# EAGLE design save (EAGLE 7.6.0)
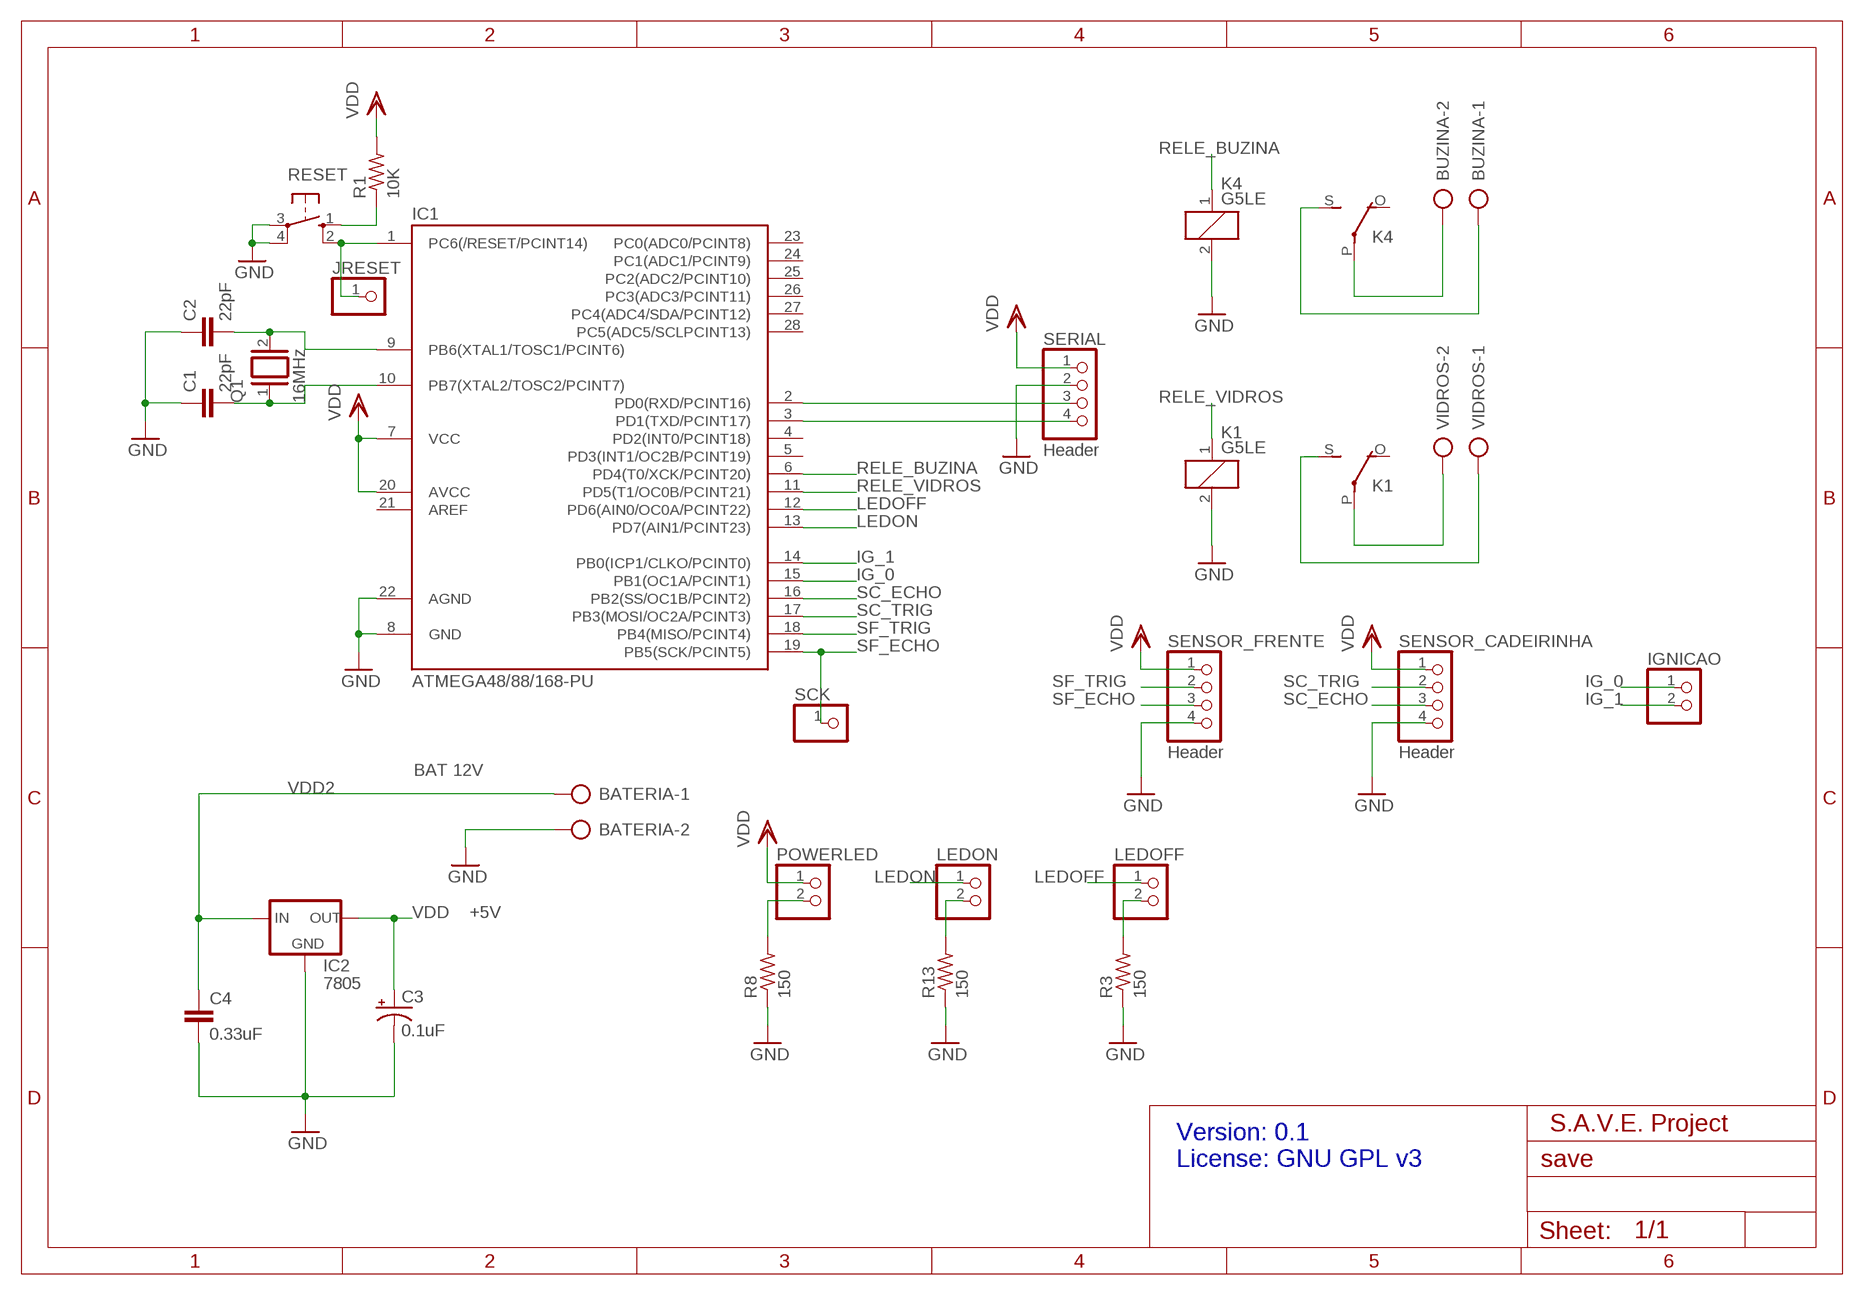
[diagram p0: schematic, sheet 1]

## Parts
BATERIA  AK300/2  [AK300/2]
BUZINA  AK300/2  [AK300/2]
C1  22pF  C-EU050-024X044  [C050-024X044]
C2  22pF  C-EU050-024X044  [C050-024X044]
C3  0.1uF  CPOL-USE2-4  [E2-4]
C4  0.33uF  C-EU025-030X050  [C025-030X050]
IC1  ATMEGA48/88/168-PU  [DIL28-3]
IC2  7805  78XXL  [78XXL]
IGNICAO  PINHD-1X2/90  [1X02/90]
JRESET  PINHD-1X1  [1X01]
K1  G5LE  [G5LE]
K4  G5LE  [G5LE]
LEDOFF  PINHD-1X2/90  [1X02/90]
LEDON  PINHD-1X2/90  [1X02/90]
POWERLED  PINHD-1X2/90  [1X02/90]
Q1  16MHz  XTAL/S  [QS]
R1  10K  R-US_0207/10  [0207/10]
R3  150  R-US_0207/10  [0207/10]
R8  150  R-US_0207/10  [0207/10]
R13  150  R-US_0207/10  [0207/10]
RESET  10-XX  [B3F-10XX]
SCK  PINHD-1X1  [1X01]
SENSOR_CADEIRINHA  Header  PINHD-1X4  [1X04]
SENSOR_FRENTE  Header  PINHD-1X4  [1X04]
SERIAL  Header  PINHD-1X4  [1X04]
VIDROS  AK300/2  [AK300/2]

## Nets
BUZINA-2: BUZINA.2 K4.P(2:P)
GND: BATERIA.2 C1.1 C2.1 C3.- C4.2 IC1.8(GND) IC1.22(AGND) IC2.GND K1.2 K4.2 R3.1 R8.1 R13.1 RESET.3(P) RESET.4(P1) SENSOR_CADEIRINHA.4 SENSOR_FRENTE.4 SERIAL.2
IG_0: IC1.15(PB1(OC1A/PCINT1)) IGNICAO.1
IG_1: IC1.14(PB0(ICP1/CLKO/PCINT0)) IGNICAO.2
LEDOFF: IC1.12(PD6(AIN0/OC0A/PCINT22)) LEDOFF.1
LEDON: IC1.13(PD7(AIN1/PCINT23)) LEDON.1
N$2: BUZINA.1 K4.S(2:S)
N$3: R1.1 RESET.1(S)
N$4: IC1.1(PC6(/RESET/PCINT14)) JRESET.1 RESET.2(S1)
N$6: C1.2 IC1.10(PB7(XTAL2/TOSC2/PCINT7)) Q1.1
N$7: C2.2 IC1.9(PB6(XTAL1/TOSC1/PCINT6)) Q1.2
N$8: K1.S(2:S) VIDROS.1
N$10: LEDOFF.2 R3.2
N$11: K1.P(2:P) VIDROS.2
N$21: POWERLED.2 R8.2
N$23: LEDON.2 R13.2
RELE_BUZINA: IC1.6(PD4(T0/XCK/PCINT20)) K4.1
RELE_VIDROS: IC1.11(PD5(T1/OC0B/PCINT21)) K1.1
RX: IC1.2(PD0(RXD/PCINT16)) SERIAL.3
SC_ECHO: IC1.16(PB2(SS/OC1B/PCINT2)) SENSOR_CADEIRINHA.3
SC_TRIG: IC1.17(PB3(MOSI/OC2A/PCINT3)) SENSOR_CADEIRINHA.2
SF_ECHO: IC1.19(PB5(SCK/PCINT5)) SCK.1 SENSOR_FRENTE.3
SF_TRIG: IC1.18(PB4(MISO/PCINT4)) SENSOR_FRENTE.2
TX: IC1.3(PD1(TXD/PCINT17)) SERIAL.4
VDD: C3.+ IC1.7(VCC) IC1.20(AVCC) IC2.OUT POWERLED.1 R1.2 SENSOR_CADEIRINHA.1 SENSOR_FRENTE.1 SERIAL.1
VDD2: BATERIA.1 C4.1 IC2.IN
Unconnected: IC1.4(PD2(INT0/PCINT18)) IC1.5(PD3(INT1/OC2B/PCINT19)) IC1.21(AREF) IC1.23(PC0(ADC0/PCINT8)) IC1.24(PC1(ADC1/PCINT9)) IC1.25(PC2(ADC2/PCINT10)) IC1.26(PC3(ADC3/PCINT11)) IC1.27(PC4(ADC4/SDA/PCINT12)) IC1.28(PC5(ADC5/SCLPCINT13)) K1.O(2:O) K4.O(2:O)

## Notes on the sheet
- BAT 12V
- +5V
- S.A.V.E. Project
- Version: 0.1
  License: GNU GPL v3

## Library data of the parts
BATERIA BUZINA VIDROS = con-ptr500:AK300/2: CONNECTOR; OC_FARNELL: unknown; OC_NEWARK: unknown
C1 C2 = rcl:C-EU: CAPACITOR, European symbol
C3 = resistor:CPOL-US: POLARIZED CAPACITOR, American symbol
C4 = resistor:C-EU: CAPACITOR, European symbol
IC1 = atmega8:ATMEGA48/88/168-PU
IC2 = v-reg:78XXL: VOLTAGE REGULATOR
IGNICAO LEDOFF LEDON POWERLED = pinhead:PINHD-1X2: PIN HEADER
JRESET SCK = pinhead:PINHD-1X1: PIN HEADER
K1 K4 = relay:G5LE: RELAY 1 x switch, 10 A/120 V AC, 8 A/30 V DC, Omron; OC_FARNELL: unknown; OC_NEWARK: unknown
Q1 = special:XTAL/S: CRYSTAL
R1 R3 R8 R13 = rcl:R-US_: RESISTOR, American symbol
RESET = switch-omron:10-XX: OMRON SWITCH; MPN: B3F-1000; OC_FARNELL: 176432; OC_NEWARK: 36M3542
SENSOR_CADEIRINHA SENSOR_FRENTE SERIAL = pinhead:PINHD-1X4: PIN HEADER

## Board
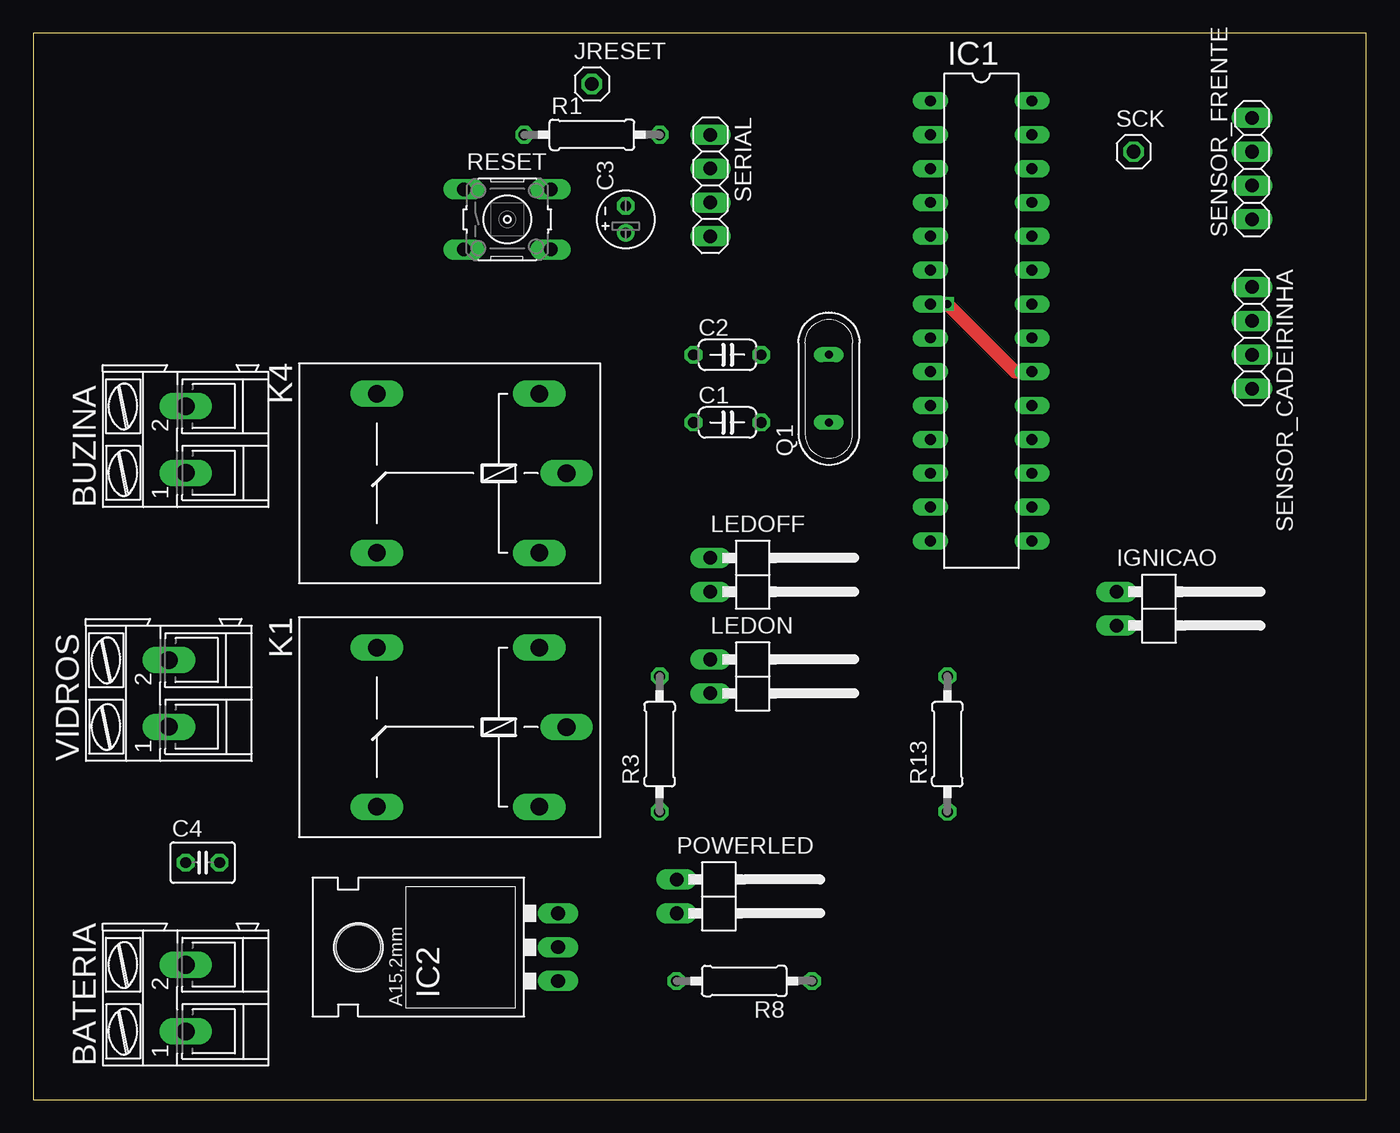
[diagram p1: board, top side]
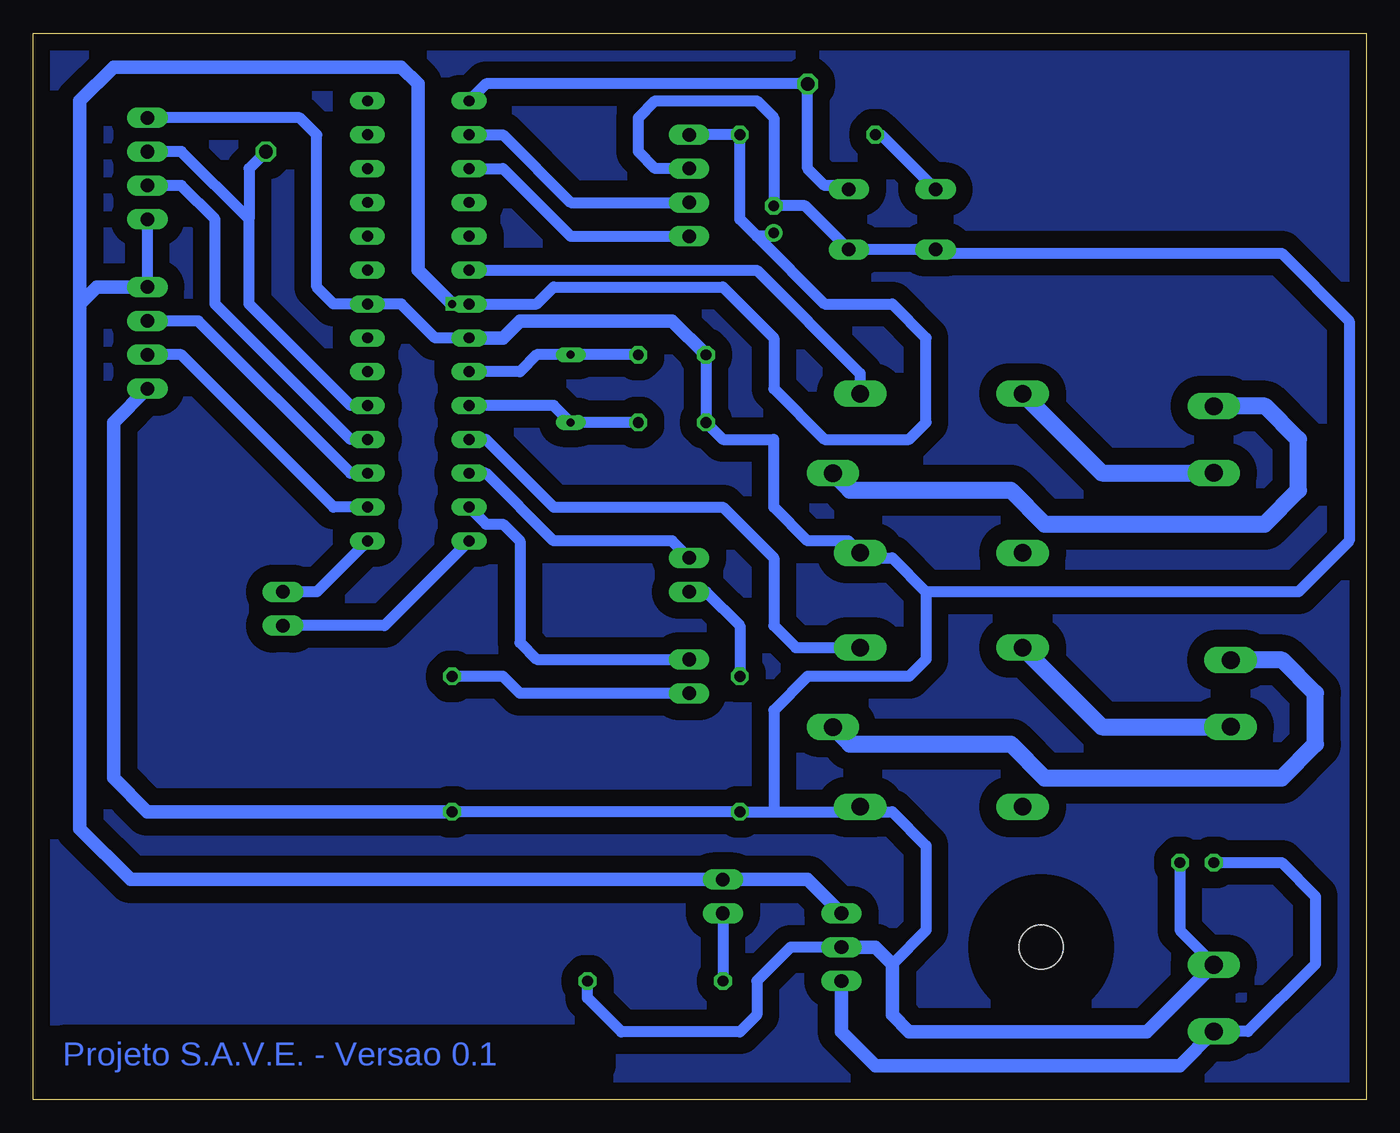
[diagram p2: board, bottom side, seen from below]

Size 100 x 80 mm. Coordinates in mm from the lower left corner, seen from the top.
Outline: 0,0 100,0 100,80 0,80 0,0
Copper layers (1*16): Top 0.035mm / dielectric 1.5mm / Bottom 0.035mm
Design rules "default": minimum track width 10mil, minimum drill 24mil, track to track 8mil, track to pad 8mil, pad to pad 8mil, via to via 8mil, smd to smd 8mil, copper to edge 40mil, drill to drill 8mil, minimum pad ring 10mil, minimum via ring 8mil, stop-mask expansion 4mil, vias tented up to drill 0mil, thermal gap 10mil

### Footprints (pad centres in the part's own frame; a part is rotated, then mirrored left to right if it is on the bottom)
AK300/2 = drill 1.321 long: 1 -2.515,0; 2 2.489,0
C050-024X044 = drill 0.813 octagon: 1 -2.54,0; 2 2.54,0
E2-4 = drill 0.813 pad 1.27: + -1.016,0 | drill 0.813 pad 1.27 octagon: - 1.016,0
C025-030X050 = drill 0.813 octagon: 1 -1.27,0; 2 1.27,0
DIL28-3 = drill 0.813 long: 1 -16.51,-3.81; 2 -13.97,-3.81; 3 -11.43,-3.81; 4 -8.89,-3.81; 5 -6.35,-3.81; 6 -3.81,-3.81; 7 -1.27,-3.81; 8 1.27,-3.81; 9 3.81,-3.81; 10 6.35,-3.81; 11 8.89,-3.81; 12 11.43,-3.81; 13 13.97,-3.81; 14 16.51,-3.81; 15 16.51,3.81; 16 13.97,3.81; 17 11.43,3.81; 18 8.89,3.81; 19 6.35,3.81; 20 3.81,3.81; 21 1.27,3.81; 22 -1.27,3.81; 23 -3.81,3.81; 24 -6.35,3.81; 25 -8.89,3.81; 26 -11.43,3.81; 27 -13.97,3.81; 28 -16.51,3.81
78XXL = drill 1.016 long: GND 0,-3.81; IN -2.54,-3.81; OUT 2.54,-3.81 | hole 3.302: 0,11.176
1X02/90 = drill 1.016 long: 1 -1.27,-3.81; 2 1.27,-3.81
1X01 = drill 1.016 octagon: 1 0,0
G5LE = drill 1.321 long: 1 -7.493,-5.969; 2 -7.493,5.969; O 4.699,5.969; P -9.525,0; S 4.699,-5.969
QS = drill 0.61 long: 1 -2.54,0; 2 2.54,0
0207/10 = drill 0.813 octagon: 1 -5.08,0; 2 5.08,0
B3F-10XX = drill 1.016 long: 1 -3.251,2.261; 2 3.251,2.261; 3 -3.251,-2.261; 4 3.251,-2.261
1X04 = drill 1.016 long: 1 -3.81,0; 2 -1.27,0; 3 1.27,0; 4 3.81,0

### Placement (x,y rotation side)
BATERIA  11.43,7.62 90 top
BUZINA  11.43,49.53 90 top
C1  52.07,50.8 0 top
C2  52.07,55.88 0 top
C3  44.45,66.04 90 top
C4  12.7,17.78 0 top
IC1  71.12,58.42 270 top
IC2  35.56,11.43 90 top
IGNICAO  85.09,36.83 270 top
JRESET  41.91,76.2 0 top
K1  30.48,27.94 180 top
K4  30.48,46.99 180 top
LEDOFF  54.61,39.37 270 top
LEDON  54.61,31.75 270 top
POWERLED  52.07,15.24 270 top
Q1  59.69,53.34 90 top
R1  41.91,72.39 0 top
R3  46.99,26.67 90 top
R8  53.34,8.89 180 top
R13  68.58,26.67 90 top
RESET  35.56,66.04 0 top
SCK  82.55,71.12 0 top
SENSOR_CADEIRINHA  91.44,57.15 270 top
SENSOR_FRENTE  91.44,69.85 90 top
SERIAL  50.8,68.58 270 top
VIDROS  10.16,30.48 90 top

### Tracks (layer width: path | path; a pad name or v marks a point on that pad's centre or on a via)
BUZINA-2
  Bottom 1.27: K4.P 38.73,45.72 26.67,45.72 24.13,43.18 7.62,43.18 5.08,45.72 5.08,49.53 7.57,52.02 BUZINA.2
GND
  Bottom 0.813: C4.2 13.97,12.7 11.43,10.16 BATERIA.2 | C2.1 C1.1 48.26,49.53 44.45,49.53 44.45,44.45 41.91,41.91 38.86,41.91 K4.2 37.59,40.64 35.56,40.64 33.02,38.1 | IC1.8 69.85,57.15 72.39,59.69 IC1.22 77.47,59.69 78.74,60.96 78.74,72.39 80.01,73.66 SENSOR_FRENTE.4 | IC2.GND 43.18,11.43 45.72,8.89 45.72,6.35 46.99,5.08 55.88,5.08 58.42,7.62 R8.1 | R13.1 R3.1 44.45,21.59 | 35.56,10.16 33.02,12.7 33.02,19.05 35.56,21.59 37.59,21.59 K1.2 37.97,21.72 38.1,21.59 44.45,21.59 | 33.02,38.1 33.02,33.02 34.29,31.75 41.91,31.75 44.45,29.21 44.45,21.59 | 33.02,38.1 5.08,38.1 1.27,41.91 1.27,58.42 6.35,63.5 32.03,63.5 RESET.3 RESET.4 42.09,67.06 C3.- 44.45,73.66 45.72,74.93 53.34,74.93 54.61,73.66 54.61,71.12 53.34,69.85 SERIAL.2
  Bottom 1.016: BATERIA.2 16.46,5.08 34.29,5.08 35.56,6.35 35.56,10.16 36.83,11.43 IC2.GND | IC1.8 64.77,57.15 63.5,58.42 52.07,58.42 C2.1 | SENSOR_CADEIRINHA.4 93.98,50.8 93.98,24.13 91.44,21.59 R13.1
IG_0
  Bottom 0.813: IC1.15 78.74,38.1 IGNICAO.1
IG_1
  Bottom 0.813: IC1.14 73.66,35.56 IGNICAO.2
LEDOFF
  Bottom 0.813: LEDOFF.1 52.07,41.91 60.96,41.91 66.04,46.99 IC1.12
LEDON
  Bottom 0.813: IC1.13 66.04,43.18 64.77,43.18 63.5,41.91 63.5,34.29 62.23,33.02 LEDON.1
N$1
  pour Bottom (isolate 1.27): 0,80.01 0,0 100.33,0 100.33,80.01
N$2
  Bottom 1.27: K4.S 19.84,47.02 BUZINA.1
N$3
  Bottom 0.813: RESET.1 36.4,72.39 R1.1
N$4
  Bottom 0.813: IC1.1 66.04,76.2 JRESET.1 41.91,69.85 40.64,68.58 39.09,68.58 RESET.2
N$6
  Bottom 0.813: IC1.10 60.96,52.07 Q1.1 C1.2
N$7
  Bottom 0.813: C2.2 Q1.2 62.23,55.88 63.5,54.61 IC1.9
N$8
  Bottom 1.27: K1.S 19.84,27.96 VIDROS.1
N$10
  Bottom 0.813: LEDOFF.2 49.53,38.1 46.99,35.56 R3.2
N$11
  Bottom 1.27: K1.P 38.73,26.67 26.67,26.67 24.13,24.13 6.35,24.13 3.81,26.67 3.81,30.48 6.3,32.97 VIDROS.2
N$21
  Bottom 0.813: POWERLED.2 R8.2
N$23
  Bottom 0.813: LEDON.2 63.5,30.48 64.77,31.75 R13.2
RELE_BUZINA
  Bottom 0.813: IC1.6 45.72,62.23 37.97,54.48 K4.1
RELE_VIDROS
  Bottom 0.813: IC1.11 66.04,49.53 60.96,44.45 48.26,44.45 44.45,40.64 44.45,35.56 42.8,33.91 K1.1
RX
  Bottom 0.813: IC1.2 64.77,72.39 59.69,67.31 SERIAL.3
SC_ECHO
  Bottom 0.813: IC1.16 77.47,44.45 88.9,55.88 SENSOR_CADEIRINHA.3
SC_TRIG
  Bottom 0.813: IC1.17 76.2,46.99 87.63,58.42 SENSOR_CADEIRINHA.2
SF_ECHO
  Bottom 0.813: IC1.19 76.2,52.07 83.82,59.69 83.82,66.04 | 83.82,66.04 88.9,71.12 SENSOR_FRENTE.3 | SCK.1 83.82,69.85 83.82,66.04
SF_TRIG
  Bottom 0.813: IC1.18 76.2,49.53 86.36,59.69 86.36,66.04 88.9,68.58 SENSOR_FRENTE.2
TX
  Bottom 0.813: IC1.3 64.77,69.85 59.69,64.77 SERIAL.4
VDD  (via drill 0.6)
  Top 1.016: v68.58,59.69 73.66,54.61 IC1.20
  Bottom 0.813: SENSOR_FRENTE.1 SENSOR_CADEIRINHA.1 | SERIAL.1 R1.2 46.99,66.04 45.72,64.77 | C3.+ 44.7,64.77 45.72,64.77 | 45.72,64.77 40.64,59.69 35.56,59.69 33.02,57.15 33.02,50.8 34.29,49.53 40.64,49.53 44.45,53.34 44.45,57.15 48.26,60.96 60.96,60.96 62.23,59.69 IC1.7
  Bottom 1.016: IC2.OUT 41.91,16.51 POWERLED.1 92.71,16.51 96.52,20.32 96.52,59.69 | 96.52,59.69 95.25,60.96 SENSOR_CADEIRINHA.1 | IC1.7 v68.58,59.69 71.12,62.23 71.12,76.2 72.39,77.47 93.98,77.47 96.52,74.93 96.52,59.69
VDD2
  Bottom 0.813: C4.1 6.35,17.78 3.81,15.24 3.81,10.16 8.87,5.11 BATERIA.1
  Bottom 1.016: BATERIA.1 13.99,2.54 36.83,2.54 39.37,5.08 IC2.IN

### Text on the board
Bottom: Projeto S.A.V.E. - Versao 0.1